# Altium project MotorBoardV2.PrjPcb
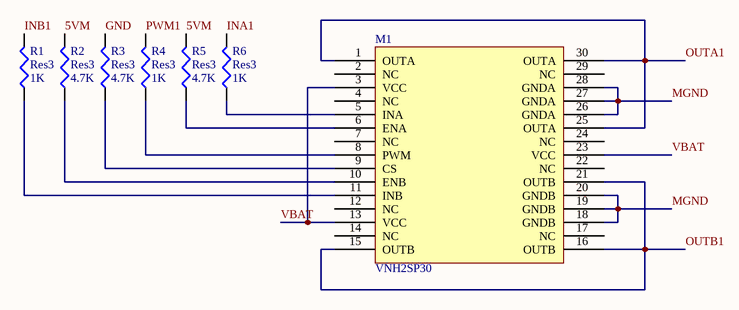
[diagram p0: MotorBoardSch.SchDoc]
1 sheet, 7 parts. Net scope: global (net labels, ports and power ports of the same name join across sheets).

## Sheet MotorBoardSch.SchDoc
size A4

### Parts
M1  VNH2SP30  [VNH5019]
R1  Res3  value 1K  [12Z-2010]
R2  Res3  value 4.7K  [12Z-2010]
R3  Res3  value 4.7K  [12Z-2010]
R4  Res3  value 1K  [12Z-2010]
R5  Res3  value 4.7K  [12Z-2010]
R6  Res3  value 1K  [12Z-2010]

### Nets
5VM: R2.2 R5.2
GND: R3.2
INA1: R6.2
INB1: R1.2
MGND: M1.18(GNDB) M1.19(GNDB) M1.20(GNDB) M1.26(GNDA) M1.27(GNDA) M1.28(GNDA)
OUTA1: M1.1(OUTA) M1.25(OUTA) M1.30(OUTA)
OUTB1: M1.15(OUTB) M1.16(OUTB) M1.21(OUTB)
PWM1: R4.2
VBAT: M1.3(VCC) M1.13(VCC) M1.23(VCC)
NetM1_5: M1.5(INA) R6.1
NetM1_6: M1.6(ENA) R5.1
NetM1_8: M1.8(PWM) R4.1
NetM1_9: M1.9(CS) R3.1
NetM1_10: M1.10(ENB) R2.1
NetM1_11: M1.11(INB) R1.1

Not connected (* = marked no-connect by the designer): M1 2(NC) 4(NC) 7(NC) 12(NC) 14(NC) 17(NC) 22(NC) 24(NC) 29(NC)

### Library data of the parts
R1-R6 = Res3: Resistor; Published: 8-Jun-2000; LatestRevisionDate: 29-May-2009; LatestRevisionNote: IPC-7351 Footprint Added.; PackageReference: J1-0603; Publisher: Altium Limited; PackageDescription: Chip Resistor